# EasyEDA Pro project 4轴3.0控制板PCB源文件LY-4X3.0-V3.4.eprj, schematic 4轴3.0-原理图-V3
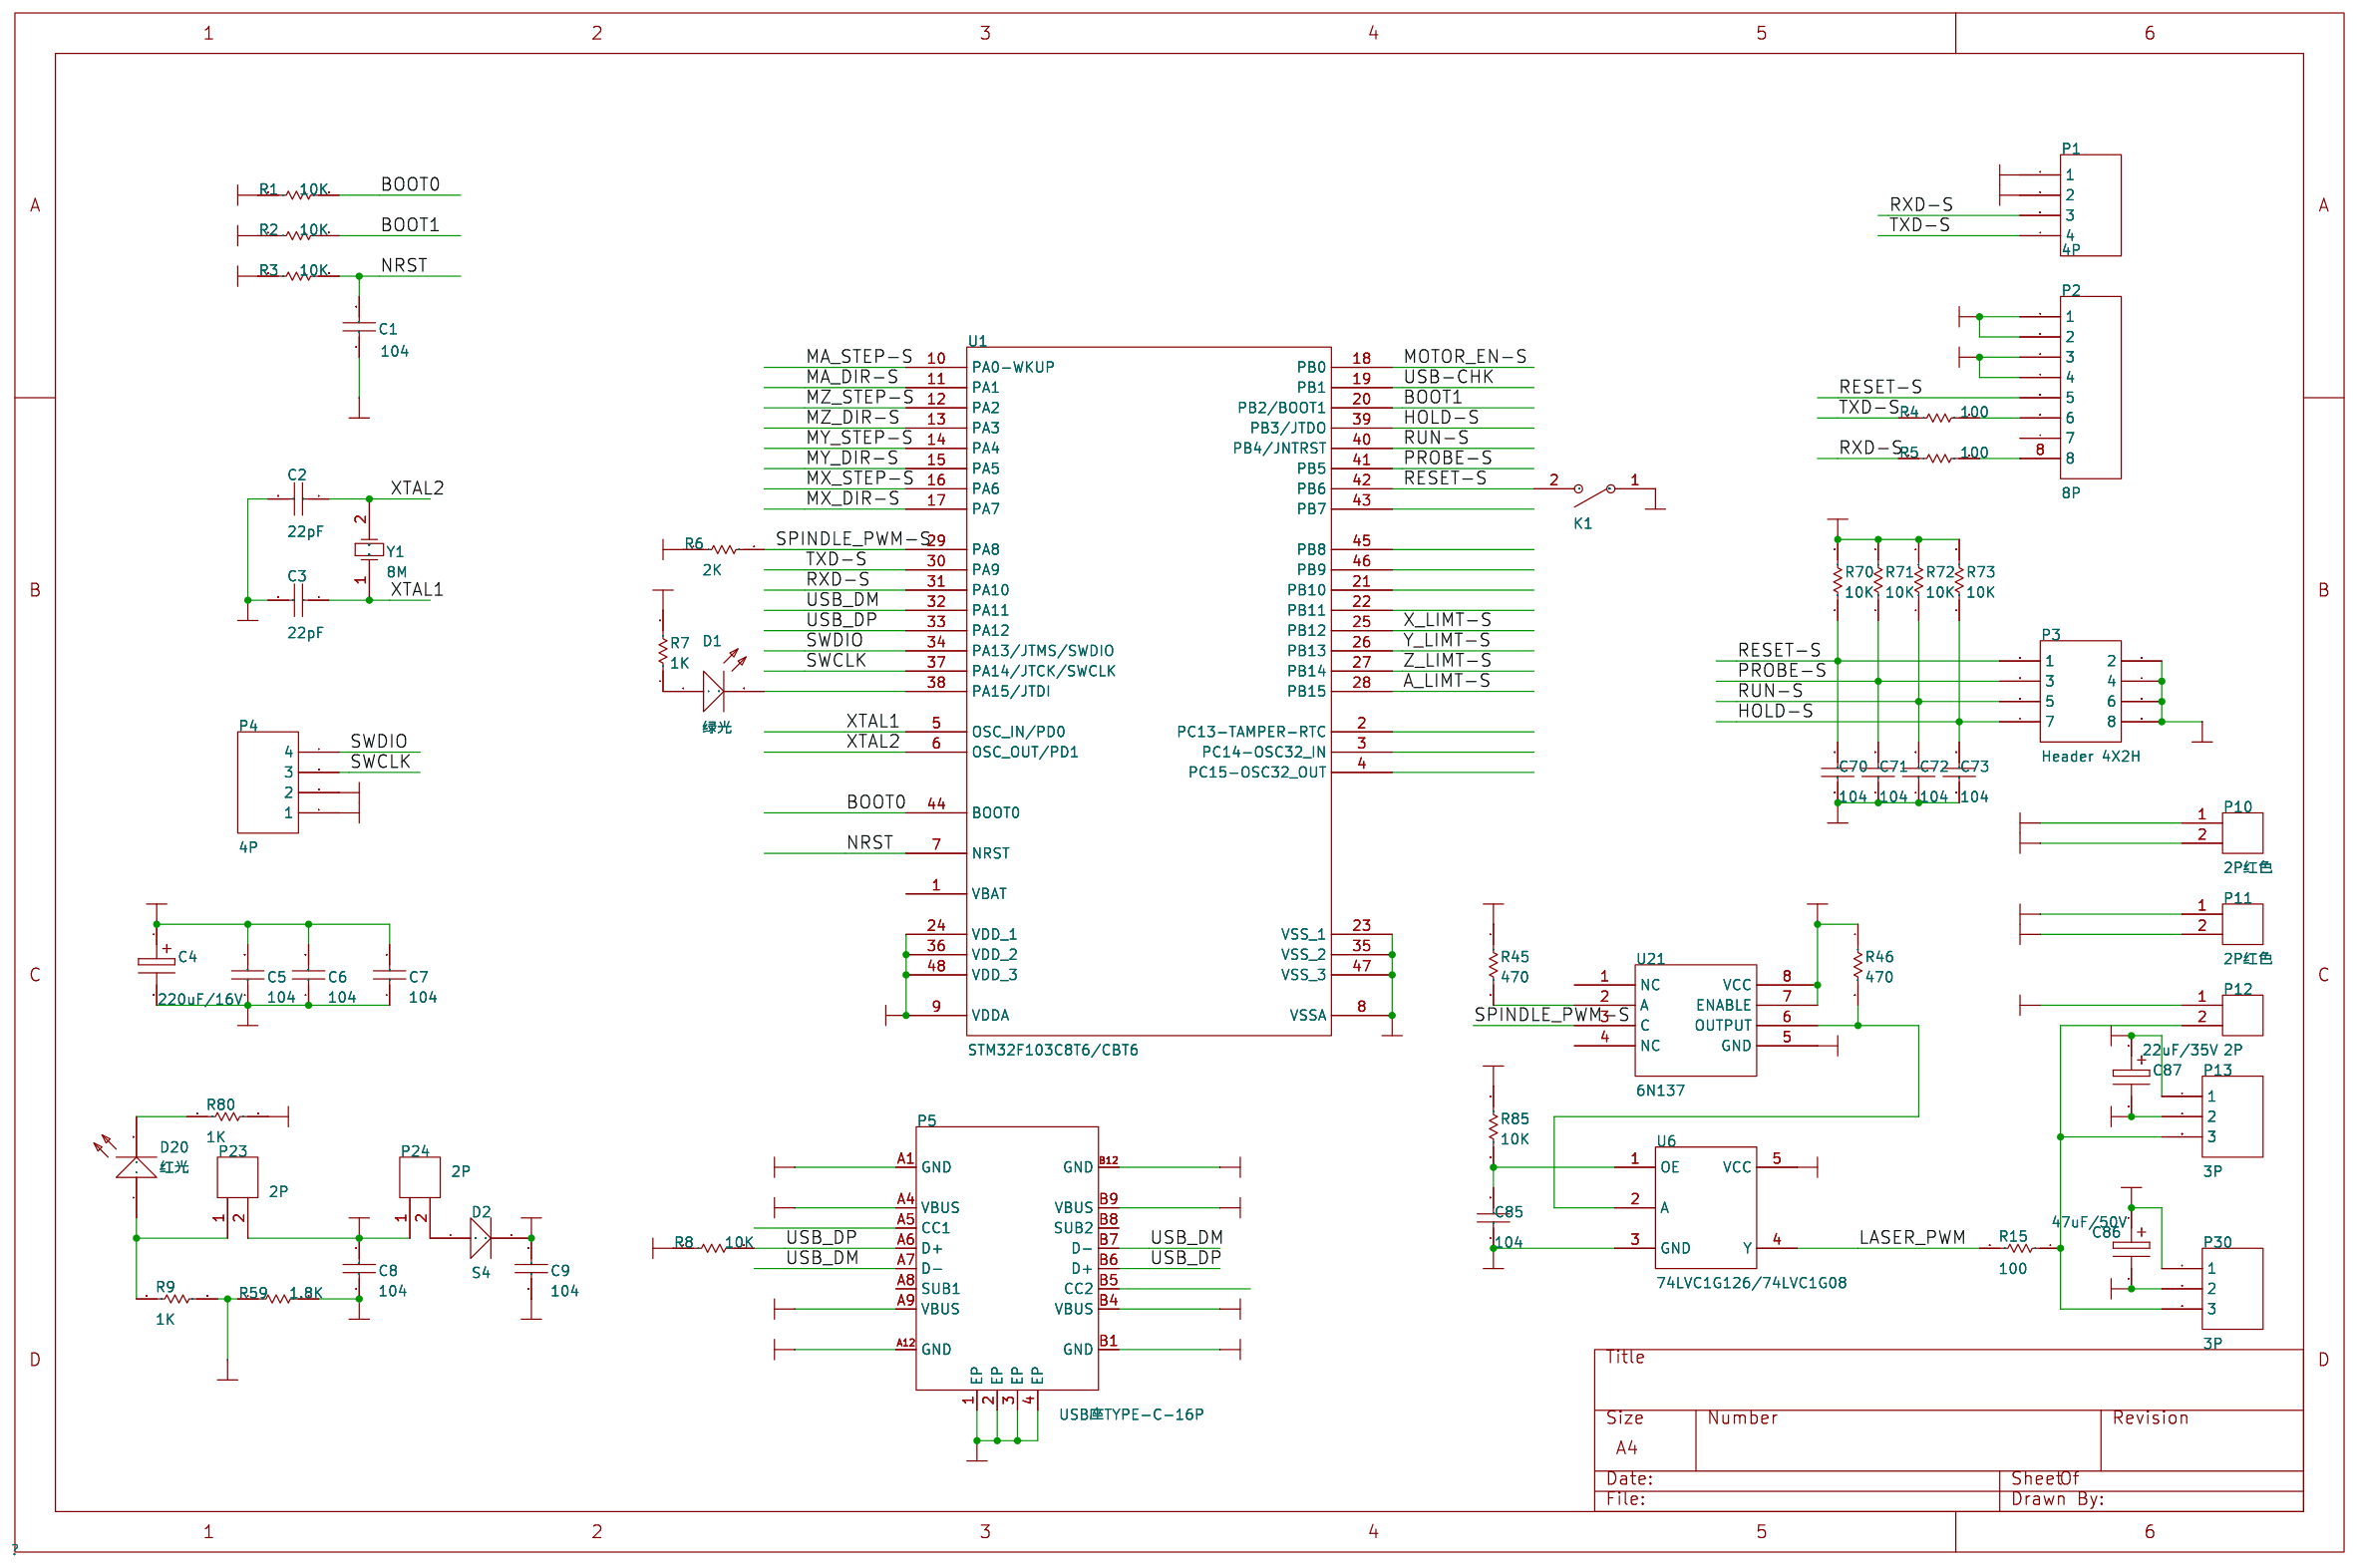
[diagram p0: schematic sheet]

## Parts
C1  104  [0603C]
C2  100pF  [0603C]
C3  100pF  [0603C]
C4  220uF/16V  [电解电容贴片6x6]
C5  104  [0603C]
C6  104  [0603C]
C7  104  [0603C]
C8  104  [0603C]
C9  104  [0603C]
C70  18pF  [0603C]
C71  18pF  [0603C]
C72  18pF  [0603C]
C73  18pF  [0603C]
C85  18pF  [0603C]
C86  47uF/50V  [电解电容贴片6x6]
C87  22uF/35V
D1  绿光  [0603LED]
D2  S4  [SOD-123]
D20  红光  [0603LED]
K1  开关  [按键6x6贴片]
P1  4P  [SIP4]
P2  8P  [IDC8]
P3  Header 4X2H  [HDR2X4H]
P4  4P  [SIP4]
P5  USB座TYPE-C-16P  [USB-TYPE-C-16P-全贴片]
P10  2P红色  [HDR1X2_CON]
P11  2P红色  [HDR1X2_CON]
P12  2P  [HDR1X2_CON]
P13  3P  [HDR1X3_CON]
P23  2P  [HDR1X2_CON]
P24  2P  [HDR1X2_CON]
P30  3P  [HDR1X3_CON]
R1  10K  [0603R]
R2  10K  [0603R]
R3  10K  [0603R]
R4  100  [0603R]
R5  100  [0603R]
R6  2K  [0603R]
R7  1K  [0603R]
R8  10K  [0603R]
R9  1K  [0603R]
R15  100  [0603R]
R45  470  [0603R]
R46  470  [0603R]
R59  1.8K  [0603R]
R70  10K  [0603R]
R71  10K  [0603R]
R72  10K  [0603R]
R73  10K  [0603R]
R80  1K  [0603R]
R85  10K  [0603R]
U1  STM32F103C8T6/CBT6  [LQFP48]
U6  74LVC1G126/74LVC1G08  [SOT-23-5]
U21  6N137  [SMD8]
Y1  8M  [晶振贴片]

## Library data of the parts
C1 C8 C9 C70-C73 C85 = 104: Capacitor (Semiconductor SIM Model); Published: 8-Jun-2000; LatestRevisionDate: 17-Jul-2002; LatestRevisionNote: Re-released for DXP Platform.; PackageReference: C1206; Publisher: Altium Limited; Origin Footprint 2: C1206; Origin Footprint 3: 0402; Origin Footprint 4: 1310[0504]; Origin Footprint 5: 1608[0603]; Origin Footprint 6: C1210; Origin Footprint 7: C0805; Origin Footprint 8: C1206; Origin Footprint 9: 0805; Origin Footprint 10: 0805L; Origin Footprint 11: 0805C; Design Item ID: Cap Semi; Library Name: Miscellaneous Devices
C2 C3 = 22pF: Capacitor (Semiconductor SIM Model); Published: 8-Jun-2000; LatestRevisionDate: 17-Jul-2002; LatestRevisionNote: Re-released for DXP Platform.; PackageReference: C1206; Publisher: Altium Limited; Origin Footprint 2: C1206; Origin Footprint 3: 0402; Origin Footprint 4: 1310[0504]; Origin Footprint 5: 1608[0603]; Origin Footprint 6: C1210; Origin Footprint 7: C0805; Origin Footprint 8: C1206; Origin Footprint 9: 0805; Origin Footprint 10: 0805L; Origin Footprint 11: 0805C; Design Item ID: Cap Semi; Library Name: Miscellaneous Devices
C4 = 220uF/16V: Origin Footprint 2: X47U; Design Item ID: ELECTRO1; Library Name: *
C5-C7 = 104: Origin Footprint 2: CAP; Origin Footprint 3: 0805C; Design Item ID: CAP; Library Name: SCH封装库
C86 = 47uF/50V: Origin Footprint 2: X47U; Design Item ID: ELECTRO1; Library Name: *
C87 = 22uF/35V: Origin Footprint 2: X47U; Origin Footprint 1: 电解电容贴片5x5; Design Item ID: ELECTRO1; Library Name: *
D1 = 绿光: Origin Footprint 2: LED(小); Design Item ID: LED; Library Name: SCH封装库
D2 = S4: Design Item ID: 1N4148; Library Name: SCH封装库
D20 = 红光: Origin Footprint 2: LED(小); Design Item ID: LED; Library Name: SCH封装库
K1 = 开关: Library Name: SCH封装库
P1 P4 = 4P: Library Name: SCH封装库
P2 = 8P: Library Name: SCH封装库
P3 = Header 4X2H: Header, 4-Pin, Dual row, Right Angle; LatestRevisionDate: 17-Jul-2002; LatestRevisionNote: Re-released for DXP Platform.; Publisher: Altium Limited; Library Name: Miscellaneous Connectors
P5 = USB座TYPE-C-16P: Supplier: LCSC; Supplier Part: C709358; Manufacturer: Shenzhen Kinghelm Elec; Manufacturer Part: KH-TYPE-C-16P-T; Library Name: SCH封装库
P10 P11 = 2P红色: Design Item ID: 2P; Library Name: SCH封装库
P12 P23 P24 = 2P: Library Name: SCH封装库
P13 P30 = 3P: Library Name: SCH封装库
R1-R3 R70-R73 = 10k: Resistor; Published: 8-Jun-2000; LatestRevisionDate: 17-Jul-2002; LatestRevisionNote: Re-released for DXP Platform.; PackageReference: AXIAL-0.3; Publisher: Altium Limited; Origin Footprint 2: AXIAL-0.3; Origin Footprint 3: 0805R; Design Item ID: RES; Library Name: SCH封装库
R4 R5 R15 = 100: Resistor; Published: 8-Jun-2000; LatestRevisionDate: 17-Jul-2002; LatestRevisionNote: Re-released for DXP Platform.; PackageReference: AXIAL-0.3; Publisher: Altium Limited; Origin Footprint 2: AXIAL-0.3; Origin Footprint 3: R0805; Origin Footprint 4: 0805R; Design Item ID: RES; Library Name: SCH封装库
R6 = 2K: Resistor; Published: 8-Jun-2000; LatestRevisionDate: 17-Jul-2002; LatestRevisionNote: Re-released for DXP Platform.; PackageReference: AXIAL-0.3; Publisher: Altium Limited; Origin Footprint 2: AXIAL-0.3; Origin Footprint 3: 0805R; Design Item ID: RES; Library Name: SCH封装库
R7 = 1K: Resistor; Published: 8-Jun-2000; LatestRevisionDate: 17-Jul-2002; LatestRevisionNote: Re-released for DXP Platform.; PackageReference: AXIAL-0.3; Publisher: Altium Limited; Origin Footprint 2: AXIAL-0.3; Origin Footprint 3: R0805; Origin Footprint 4: 0805R; Design Item ID: RES; Library Name: SCH封装库
R8 = 10k: Resistor; Published: 8-Jun-2000; LatestRevisionDate: 17-Jul-2002; LatestRevisionNote: Re-released for DXP Platform.; PackageReference: AXIAL-0.3; Publisher: Altium Limited; Origin Footprint 2: AXIAL-0.3; Origin Footprint 3: R0805; Design Item ID: RES; Library Name: SCH封装库
R9 R80 = 1K: Resistor; Published: 8-Jun-2000; LatestRevisionDate: 17-Jul-2002; LatestRevisionNote: Re-released for DXP Platform.; PackageReference: AXIAL-0.3; Publisher: Altium Limited; Origin Footprint 2: AXIAL-0.3; Origin Footprint 3: R0805; Design Item ID: RES; Library Name: SCH封装库
R45 R46 = 470: Resistor; Published: 8-Jun-2000; LatestRevisionDate: 17-Jul-2002; LatestRevisionNote: Re-released for DXP Platform.; PackageReference: AXIAL-0.3; Publisher: Altium Limited; Origin Footprint 2: AXIAL-0.3; Origin Footprint 3: R0805; Origin Footprint 4: 0805R; Design Item ID: RES; Library Name: SCH封装库
R59 = 1.8K: Resistor; Published: 8-Jun-2000; LatestRevisionDate: 17-Jul-2002; LatestRevisionNote: Re-released for DXP Platform.; PackageReference: AXIAL-0.3; Publisher: Altium Limited; Origin Footprint 2: AXIAL-0.3; Origin Footprint 3: R0805; Design Item ID: RES; Library Name: SCH封装库
R85 = 10k: Resistor; Published: 8-Jun-2000; LatestRevisionDate: 17-Jul-2002; LatestRevisionNote: Re-released for DXP Platform.; PackageReference: AXIAL-0.3; Publisher: Altium Limited; Origin Footprint 2: AXIAL-0.3; Origin Footprint 3: R0805; Origin Footprint 4: 0805R; Design Item ID: RES; Library Name: SCH封装库
U1 = STM32F103C8T6/CBT6: STM32 ARM-based 32-bit MCU with 32 Kbytes Flash, 48-pin LQFP, Industrial Temperature; Published: *; DatasheetVersion: *; PackageVersion: *; PackageReference: *; Publisher: *; PackageDescription: *; ComponentLink1Description: *; ComponentLink1URL: *; ComponentLink2Description: *; ComponentLink2URL: *; Origin Footprint 2: LQFP48_L; Origin Footprint 3: LQFP48_M; Design Item ID: STM32F103C6T6; Library Name: ST Microcontroller 32-Bit STM32 SCH
U6 = 74LVC1G126/74LVC1G08: Design Item ID: 74LVC1G126; Library Name: SCH封装库
U21 = 6N137: Library Name: SCH封装库
Y1 = 8M: Crystal Oscillator; Published: 8-Jun-2000; LatestRevisionDate: 17-Jul-2002; LatestRevisionNote: Re-released for DXP Platform.; PackageReference: R38; Publisher: Altium Limited; Origin Footprint 2: R38; Origin Footprint 3: XTAL-49S; Design Item ID: XTAL; Library Name: Miscellaneous Devices

## Nets
3V3-S: C4.1 C5.2 C6.2 C7.2 P4.2 R3.1 R7.2 R8.1 R45.1 R70.2 R71.2 R72.2 R73.2 U1.9(VDDA) U1.24(VDD_1) U1.36(VDD_2) U1.48(VDD_3)
12V: C87.1 P11.2 P13.1
24V: C86.1 P10.2 P30.1
GND: C85.1 C86.2 C87.2 P10.1 P11.1 P12.1 P13.2 P30.2 U6.3(GND) U21.5(GND)
GND-S: C1.1 C2.2 C3.2 C4.2 C5.1 C6.1 C7.1 C8.1 C9.1 C70.1 C71.1 C72.1 C73.1 K1.1(COMMON) P1.2 P2.3 P2.4 P3.2 P3.4 P3.6 P3.8 P4.1 P5.1(EP) P5.2(EP) P5.3(EP) P5.4(EP) P5.A1(GND) P5.A12(GND) P5.B1(GND) P5.B12(GND) R1.1 R2.1 R6.1 R59.2 R80.2 U1.8(VSSA) U1.23(VSS_1) U1.35(VSS_2) U1.47(VSS_3)
VCC: R46.1 R85.1 U6.5(VCC) U21.7(ENABLE) U21.8(VCC)
VCC-S: C9.2 D2.2 P1.1 P2.1 P2.2
A_LIMT-S: U1.28(PB15)
BOOT0: R1.2 U1.44(BOOT0)
BOOT1: R2.2 U1.20(PB2/BOOT1)
HOLD-S: C73.2 P3.7 R73.1 U1.39(PB3/JTDO)
LASER_PWM: R15.2 U6.4(Y)
MA_DIR-S: U1.11(PA1)
MA_STEP-S: U1.10(PA0-WKUP)
MOTOR_EN-S: U1.18(PB0)
MX_DIR-S: U1.17(PA7)
MX_STEP-S: U1.16(PA6)
MY_DIR-S: U1.15(PA5)
MY_STEP-S: U1.14(PA4)
MZ_DIR-S: U1.13(PA3)
MZ_STEP-S: U1.12(PA2)
NRST: C1.2 R3.2 U1.7(NRST)
PROBE-S: C71.2 P3.3 R71.1 U1.41(PB5)
RESET-S: C70.2 K1.2(NO) P2.5 P3.1 R70.1 U1.42(PB6)
RUN-S: C72.2 P3.5 R72.1 U1.40(PB4/JNTRST)
RXD-S: P1.3 R5.1 U1.31(PA10)
SPINDLE_PWM-S: R6.2 U1.29(PA8) U21.3(C)
SWCLK: P4.3 U1.37(PA14/JTCK/SWCLK)
SWDIO: P4.4 U1.34(PA13/JTMS/SWDIO)
TXD-S: P1.4 R4.1 U1.30(PA9)
USB-CHK: R9.2 R59.1 U1.19(PB1)
USB_DM: P5.A7(D-) P5.B7(D-) U1.32(PA11)
USB_DP: P5.A6(D+) P5.B6(D+) R8.2 U1.33(PA12)
VUSB: C8.2 P5.A4(VBUS) P5.A9(VBUS) P5.B4(VBUS) P5.B9(VBUS) P23.2 P24.1
X_LIMT-S: U1.25(PB12)
XTAL1: C3.1 U1.5(OSC_IN/PD0) Y1.1(OSC1)
XTAL2: C2.1 U1.6(OSC_OUT/PD1) Y1.2(OSC2)
Y_LIMT-S: U1.26(PB13)
Z_LIMT-S: U1.27(PB14)
NETC85_2: C85.2 R85.2 U6.1(OE)
NETD1_1: D1.1 R7.1
NETD1_2: D1.2 U1.38(PA15/JTDI)
NETD2_1: D2.1 P24.2
NETD20_1: D20.1 P23.1 R9.1
NETD20_2: D20.2 R80.1
NETP2_6: P2.6 R4.2
NETP2_8: P2.8 R5.2
NETP12_2: P12.2 P13.3 P30.3 R15.1
NETR45_2: R45.2 U21.2(A)
NETR46_2: R46.2 U6.2(A) U21.6(OUTPUT)

Not connected (* = marked no-connect by the designer): P2 7; P5 A5(CC1) A8(SUB1) B5(CC2) B8(SUB2); U1 1(VBAT) 2(PC13-TAMPER-RTC) 3(PC14-OSC32_IN) 4(PC15-OSC32_OUT) 21(PB10) 22(PB11) 43(PB7) 45(PB8) 46(PB9); U21 1(NC) 4(NC)
